# Altium schematic sheet SD.SchDoc
size A4; SheetNumber: 3; SheetTotal: 5
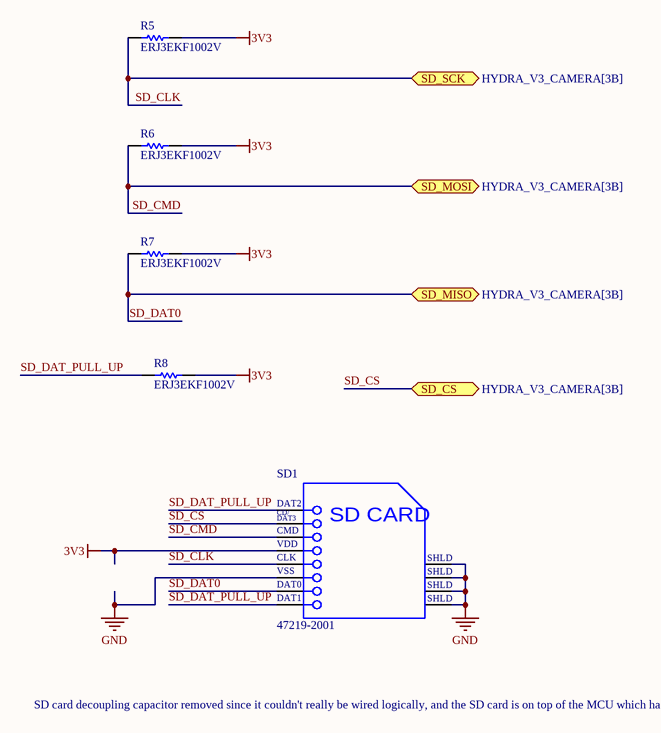
[diagram p0: SD.SchDoc]

## Parts
R5  ERJ3EKF1002V  [RESC1609X55X30LL15T15]
R6  ERJ3EKF1002V  [RESC1609X55X30LL15T15]
R7  ERJ3EKF1002V  [RESC1609X55X30LL15T15]
R8  ERJ3EKF1002V  [RESC1609X55X30LL15T15]
SD1  47219-2001  [MOLX-47219-2001-8_V]

## Ports
SD_CS (bidir, see HYDRA_V3_CAMERA[3B]), SD_MISO (bidir, see HYDRA_V3_CAMERA[3B]), SD_MOSI (bidir, see HYDRA_V3_CAMERA[3B]), SD_SCK (bidir, see HYDRA_V3_CAMERA[3B])

## Nets
3V3: R5.2 R6.2 R7.2 R8.2 SD1.4(VDD)
GND: SD1.6(VSS) SD1.9(SHLD) SD1.10(SHLD) SD1.11(SHLD) SD1.12(SHLD)
SD_CLK: R5.1 SD1.5(CLK) ; port SD_SCK
SD_CMD: R6.1 SD1.3(CMD) ; port SD_MOSI
SD_CS: SD1.2(CD/DAT3) ; port SD_CS
SD_DAT0: R7.1 SD1.7(DAT0) ; port SD_MISO
SD_DAT_PULL_UP: R8.1 SD1.1(DAT2) SD1.8(DAT1)

## Notes on the sheet
- SD card decoupling capacitor removed since it couldn't really be wired logically, and the SD card is on top of the MCU which has a wealth of decoupling capacitors linked to the power plane near the SD card's supply plane which is also linked to the power plane
- (in symbol CMP-2000-05245-1) CD/; DAT3; SD CARD

## Library data of the parts
R5-R8 = CMP-1012-00623-3: Chip Resistor, 10 KOhm, +/- 1%, 0.1 W, -55 to 155 degC, 0603 (1608 Metric), RoHS, Tape and Reel; Manufacturer: Panasonic; Voltage Rating: 75V; Case\/Package: 0603; Power Rating: 100mW; Resistance: 10KOhm; Temperature Coefficient: 100ppm\/degreesC; Number of Pins: 2; Package Reference: 603; Depth: 0.8mm; Mount: SurfaceMount; Package Description: 2-Pin Surface Mount Device, Body 1.6 x 0.85 mm; Datasheet Version: 02/2017; Length: 1.6mm; Lead Free: LeadFree; Height: 0.45mm; Number of Terminations: 2; Max Power Dissipation: 100mW; Min Operating Temperature: -55degC; Datasheet URL: https://industrial.panasonic.com/cdbs/www-data/pdf/RDA0000/AOA0000C304.pdf; Termination: SMD/SMT; Case Code (Metric): 1608; Case Code (Imperial): 0603; Tolerance: 1%; Max Operating Temperature: 155degC; RoHSCompliant: true; Voltage Rating (DC): 75V; Radiation Hardening: No; Packaging: TapeandReel; Composition: ThickFilm; Mounting Technology: SurfaceMount; Manufacturer URL: http://www.panasonic.com/; Width: 0.031inch; REACH SVHC: NoSVHC; Contact Plating: Tin; Military Standard: Not; Package Quantity: 1
SD1 = CMP-2000-05245-1: MicroSD Card Connector, Hinge Type, -40 to 85 degC, 8-Pin SMD, RoHS, Tape and Reel; Manufacturer: Molex; Current Rating: 500mA; Number of Contacts: 8; Pitch: 1.09mm; Insertion - Extraction Style: Hinged; Voltage Rating: 100VDC; Product: CardConnectors; Contact Material: CopperAlloy; Series: 47219; Packaging: Reel; Brand: Molex; Product Category: MemoryCardConnectors; Housing Material: Thermoplastic; Mounting Style: SMD/SMT; Termination Style: SMD; Datasheet Version: Rev. F, 06/2009; Card Type: microSD; Manufacturer URL: http://www.molex.com/; RoHS: Details; Datasheet URL: http://www.molex.com/pdm_docs/sd/472192001_sd.pdf; Factory Pack Quantity: 2400